# Altium schematic sheet probe.SchDoc
size A4
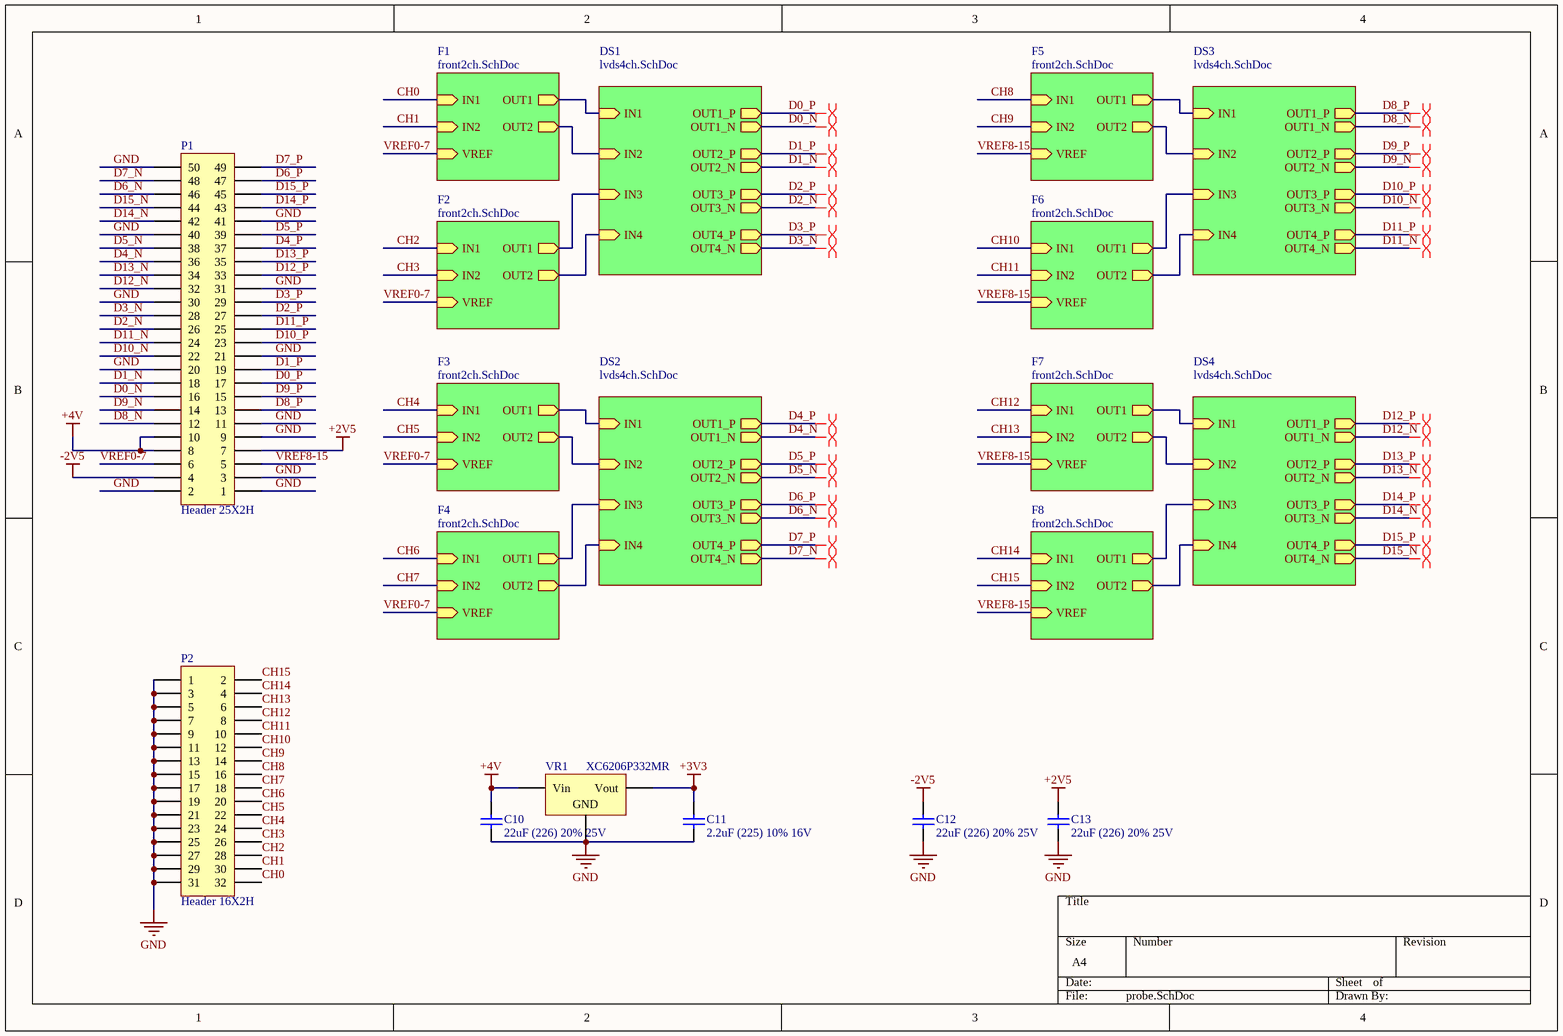
[diagram p0: probe.SchDoc]

## Parts
C10  22uF (226) 20% 25V  [0805_C]
C11  2.2uF (225) 10% 16V  [0603_C]
C12  22uF (226) 20% 25V  [0805_C]
C13  22uF (226) 20% 25V  [0805_C]
P1  Header 25X2H  [HDR2X25H]
P2  Header 16X2H  [HDR2X16H]
VR1  XC6206P332MR  [SOT-23-3L]

## Sub-sheets
DS1 = lvds4ch.SchDoc: OUT4_N (out), OUT3_P (out), OUT2_P (out), OUT1_P (out), OUT4_P (out), OUT2_N (out), OUT3_N (out), IN4 (in), IN3 (in), OUT1_N (out), IN1 (in), IN2 (in)
DS2 = lvds4ch.SchDoc: OUT4_N (out), OUT3_P (out), OUT2_P (out), OUT1_P (out), OUT4_P (out), OUT2_N (out), OUT3_N (out), IN4 (in), IN3 (in), OUT1_N (out), IN1 (in), IN2 (in)
DS3 = lvds4ch.SchDoc: OUT4_N (out), OUT3_P (out), OUT2_P (out), OUT1_P (out), OUT4_P (out), OUT2_N (out), OUT3_N (out), IN4 (in), IN3 (in), OUT1_N (out), IN1 (in), IN2 (in)
DS4 = lvds4ch.SchDoc: OUT4_N (out), OUT3_P (out), OUT2_P (out), OUT1_P (out), OUT4_P (out), OUT2_N (out), OUT3_N (out), IN4 (in), IN3 (in), OUT1_N (out), IN1 (in), IN2 (in)
F1 = front2ch.SchDoc: IN1 (in), OUT1 (out), IN2 (in), VREF (in), OUT2 (out)
F2 = front2ch.SchDoc: IN1 (in), OUT1 (out), IN2 (in), VREF (in), OUT2 (out)
F3 = front2ch.SchDoc: IN1 (in), OUT1 (out), IN2 (in), VREF (in), OUT2 (out)
F4 = front2ch.SchDoc: IN1 (in), OUT1 (out), IN2 (in), VREF (in), OUT2 (out)
F5 = front2ch.SchDoc: IN1 (in), OUT1 (out), IN2 (in), VREF (in), OUT2 (out)
F6 = front2ch.SchDoc: IN1 (in), OUT1 (out), IN2 (in), VREF (in), OUT2 (out)
F7 = front2ch.SchDoc: IN1 (in), OUT1 (out), IN2 (in), VREF (in), OUT2 (out)
F8 = front2ch.SchDoc: IN1 (in), OUT1 (out), IN2 (in), VREF (in), OUT2 (out)

## Nets
+2V5: C13.2 P1.7
+3V3: C11.2 VR1.2(Vout)
+4V: C10.2 P1.8 P1.10 VR1.3(Vin)
-2V5: C12.2 P1.4
GND: C10.1 C11.1 C12.1 C13.1 P1.1 P1.2 P1.3 P1.9 P1.11 P1.20 P1.21 P1.30 P1.31 P1.40 P1.41 P1.50 P2.1 P2.3 P2.5 P2.7 P2.9 P2.11 P2.13 P2.15 P2.17 P2.19 P2.21 P2.23 P2.25 P2.27 P2.29 P2.31 VR1.1(GND)
CH0: P2.32 ; sheet F1/IN1
CH1: P2.30 ; sheet F1/IN2
CH2: P2.28 ; sheet F2/IN1
CH3: P2.26 ; sheet F2/IN2
CH4: P2.24 ; sheet F3/IN1
CH5: P2.22 ; sheet F3/IN2
CH6: P2.20 ; sheet F4/IN1
CH7: P2.18 ; sheet F4/IN2
CH8: P2.16 ; sheet F5/IN1
CH9: P2.14 ; sheet F5/IN2
CH10: P2.12 ; sheet F6/IN1
CH11: P2.10 ; sheet F6/IN2
CH12: P2.8 ; sheet F7/IN1
CH13: P2.6 ; sheet F7/IN2
CH14: P2.4 ; sheet F8/IN1
CH15: P2.2 ; sheet F8/IN2
D0_N: P1.16 ; sheet DS1/OUT1_N
D0_P: P1.17 ; sheet DS1/OUT1_P
D1_N: P1.18 ; sheet DS1/OUT2_N
D1_P: P1.19 ; sheet DS1/OUT2_P
D2_N: P1.26 ; sheet DS1/OUT3_N
D2_P: P1.27 ; sheet DS1/OUT3_P
D3_N: P1.28 ; sheet DS1/OUT4_N
D3_P: P1.29 ; sheet DS1/OUT4_P
D4_N: P1.36 ; sheet DS2/OUT1_N
D4_P: P1.37 ; sheet DS2/OUT1_P
D5_N: P1.38 ; sheet DS2/OUT2_N
D5_P: P1.39 ; sheet DS2/OUT2_P
D6_N: P1.46 ; sheet DS2/OUT3_N
D6_P: P1.47 ; sheet DS2/OUT3_P
D7_N: P1.48 ; sheet DS2/OUT4_N
D7_P: P1.49 ; sheet DS2/OUT4_P
D8_N: P1.12 ; sheet DS3/OUT1_N
D8_P: P1.13 ; sheet DS3/OUT1_P
D9_N: P1.14 ; sheet DS3/OUT2_N
D9_P: P1.15 ; sheet DS3/OUT2_P
D10_N: P1.22 ; sheet DS3/OUT3_N
D10_P: P1.23 ; sheet DS3/OUT3_P
D11_N: P1.24 ; sheet DS3/OUT4_N
D11_P: P1.25 ; sheet DS3/OUT4_P
D12_N: P1.32 ; sheet DS4/OUT1_N
D12_P: P1.33 ; sheet DS4/OUT1_P
D13_N: P1.34 ; sheet DS4/OUT2_N
D13_P: P1.35 ; sheet DS4/OUT2_P
D14_N: P1.42 ; sheet DS4/OUT3_N
D14_P: P1.43 ; sheet DS4/OUT3_P
D15_N: P1.44 ; sheet DS4/OUT4_N
D15_P: P1.45 ; sheet DS4/OUT4_P
VREF0-7: P1.6 ; sheet F1/VREF, sheet F2/VREF, sheet F3/VREF, sheet F4/VREF
VREF8-15: P1.5 ; sheet F5/VREF, sheet F6/VREF, sheet F7/VREF, sheet F8/VREF
(unnamed): sheet F1/OUT1, sheet DS1/IN1
(unnamed): sheet F1/OUT2, sheet DS1/IN2
(unnamed): sheet F2/OUT1, sheet DS1/IN3
(unnamed): sheet F2/OUT2, sheet DS1/IN4
(unnamed): sheet F3/OUT1, sheet DS2/IN1
(unnamed): sheet F3/OUT2, sheet DS2/IN2
(unnamed): sheet F4/OUT1, sheet DS2/IN3
(unnamed): sheet F4/OUT2, sheet DS2/IN4
(unnamed): sheet F5/OUT1, sheet DS3/IN1
(unnamed): sheet F5/OUT2, sheet DS3/IN2
(unnamed): sheet F6/OUT1, sheet DS3/IN3
(unnamed): sheet F6/OUT2, sheet DS3/IN4
(unnamed): sheet F7/OUT1, sheet DS4/IN1
(unnamed): sheet F7/OUT2, sheet DS4/IN2
(unnamed): sheet F8/OUT1, sheet DS4/IN3
(unnamed): sheet F8/OUT2, sheet DS4/IN4

## Layout directives
differential pair: D0_N, D0_P, D1_N, D1_P, D2_N, D2_P, D3_N, D3_P, D4_N, D4_P, D5_N, D5_P, D6_N, D6_P, D7_N, D7_P, D8_N, D8_P, D9_N, D9_P, D10_N, D10_P, D11_N, D11_P, D12_N, D12_P, D13_N, D13_P, D14_N, D14_P, D15_N, D15_P

## Library data of the parts
C10 C12 C13 = 0805 22uF (226) 20% 25V: 贴片电容; ComponentLink1Description: 供应商链接; ComponentLink1URL: http://www.szlcsc.com/product/details_46786.html; Package: 0805; Supplier: LC; SuppliersPartNumber: C45783
C11 = 0603 2.2uF (225) 10% 16V: 贴片电容; ComponentLink1Description: 供应商链接; ComponentLink1URL: http://www.szlcsc.com/product/details_24366.html; Package: 0603; Supplier: LC; SuppliersPartNumber: C23630
P1 = Header 25X2H: Header, 25-Pin, Dual row, Right Angle; LatestRevisionDate: 17-Jul-2002; LatestRevisionNote: Re-released for DXP Platform.; Publisher: Altium Limited
P2 = Header 16X2H: Header, 16-Pin, Dual row, Right Angle; LatestRevisionDate: 17-Jul-2002; LatestRevisionNote: Re-released for DXP Platform.; Publisher: Altium Limited
VR1 = SOT-23 XC6206P332MR: 低压差线性稳压(LDO); ComponentLink1Description: 供应商链接; ComponentLink1URL: http://www.szlcsc.com/product/details_5896.html; Package: SOT-23; Supplier: LC; SuppliersPartNumber: C5446